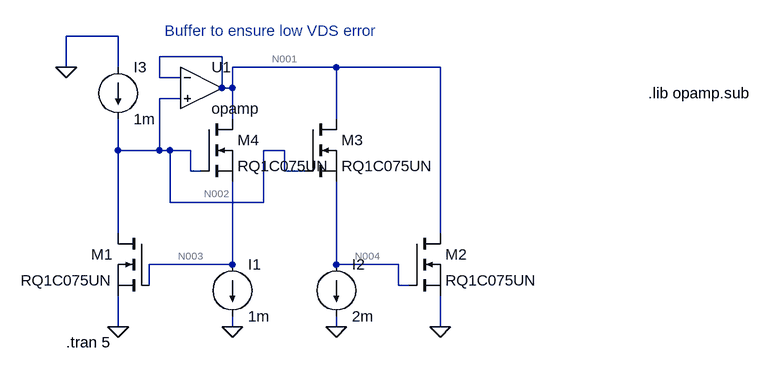
[diagram p0: schematic translinear_ratio_NMOS.asc]
translinear_ratio_NMOS.asc, the LTspice schematic file:
Version 4
SHEET 1 1132 680
WIRE 144 -224 64 -224
WIRE 304 -192 208 -192
WIRE 64 -176 64 -224
WIRE 144 -176 144 -224
WIRE 480 -176 320 -176
WIRE 640 -176 480 -176
WIRE 208 -160 208 -192
WIRE 240 -160 208 -160
WIRE 304 -144 304 -192
WIRE 320 -144 320 -176
WIRE 320 -144 304 -144
WIRE 240 -128 208 -128
WIRE 320 -96 320 -144
WIRE 480 -96 480 -176
WIRE 144 -48 144 -96
WIRE 208 -48 208 -128
WIRE 208 -48 144 -48
WIRE 224 -48 208 -48
WIRE 256 -48 224 -48
WIRE 400 -48 368 -48
WIRE 256 -16 256 -48
WIRE 272 -16 256 -16
WIRE 400 -16 400 -48
WIRE 432 -16 400 -16
WIRE 224 32 224 -48
WIRE 368 32 368 -48
WIRE 368 32 224 32
WIRE 144 80 144 -48
WIRE 640 80 640 -176
WIRE 320 128 320 0
WIRE 320 128 192 128
WIRE 480 128 480 0
WIRE 576 128 480 128
WIRE 192 160 192 128
WIRE 576 160 576 128
WIRE 592 160 576 160
WIRE 144 224 144 176
WIRE 320 224 320 208
WIRE 480 224 480 208
WIRE 640 224 640 176
FLAG 144 224 0
FLAG 320 224 0
FLAG 640 224 0
FLAG 480 224 0
FLAG 64 -176 0
SYMBOL current 320 128 R0
WINDOW 123 0 0 Left 0
WINDOW 39 0 0 Left 0
SYMATTR InstName I1
SYMATTR Value 1m
SYMBOL current 480 128 R0
WINDOW 123 0 0 Left 0
WINDOW 39 0 0 Left 0
SYMATTR InstName I2
SYMATTR Value 2m
SYMBOL current 144 -176 R0
WINDOW 123 0 0 Left 0
WINDOW 39 0 0 Left 0
SYMATTR InstName I3
SYMATTR Value 1m
SYMBOL Opamps\\opamp 272 -208 R0
SYMATTR InstName U1
SYMBOL nmos 192 80 M0
SYMATTR InstName M1
SYMATTR Value RQ1C075UN
SYMBOL nmos 592 80 R0
SYMATTR InstName M2
SYMATTR Value RQ1C075UN
SYMBOL nmos 432 -96 R0
SYMATTR InstName M3
SYMATTR Value RQ1C075UN
SYMBOL nmos 272 -96 R0
SYMATTR InstName M4
SYMATTR Value RQ1C075UN
TEXT 64 248 Left 2 !.tran 5
TEXT 960 -136 Left 2 !.lib opamp.sub
TEXT 216 -232 Left 2 ;Buffer to ensure low VDS error

The netlist it stands for:
* translinear_ratio_NMOS.asc
I1 N003 0 1m
I2 N004 0 2m
I3 0 N002 1m
XU1 N001 N002 N001 opamp Aol=100K GBW=10Meg  ; pins invin noninvin out
M1 N002 N003 0 0 RQ1C075UN
M2 N001 N004 0 0 RQ1C075UN
M3 N001 N002 N004 N004 RQ1C075UN
M4 N001 N002 N003 N003 RQ1C075UN
.model NMOS NMOS
.model PMOS PMOS
.lib standard.mos
.tran 5
.lib opamp.sub
* Buffer to ensure low VDS error
.backanno
.end

* Results of the author's LTspice run, read from the files saved beside the schematic
* Operating Point, zero values left out:
*   V(n003) = 532.7 mV
*   V(n004) = 497.4 mV
*   V(n002) = 1.067 V
*   V(n001) = 1.067 V
*   Id(M4) = 1 mA
*   Is(M4) = -1 mA
*   Id(M3) = 2 mA
*   Is(M3) = -2 mA
*   Id(M2) = 498.6 µA
*   Is(M2) = -498.6 µA
*   Id(M1) = 1 mA
*   Is(M1) = -1 mA
*   I(I3) = 1 mA
*   I(I2) = 2 mA
*   I(I1) = 1 mA
*   Ix(u1:3) = -3.499 mA